# Altium schematic sheet SD.SchDoc
size A4
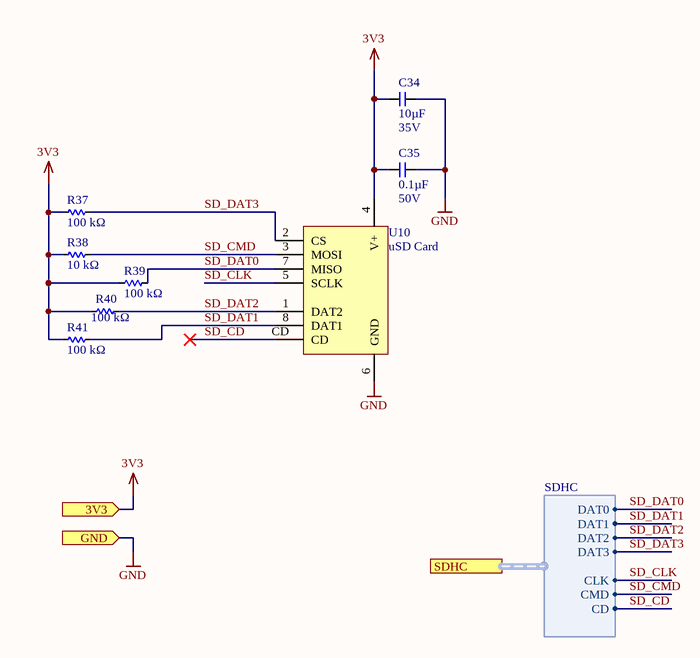
[diagram p0: SD.SchDoc]

## Parts
C34  Capacitance (shorthand): 10µF  Rated Voltage: 35V  [C0603]  (hidden comment: 490-13248-1-ND)
C35  Capacitance (shorthand): 0.1µF  Rated Voltage: 50V  [C0603]  (hidden comment: 490-1519-1-ND)
R37  Resistance: 100 kΩ  [R0603]  (hidden comment: 311-100KHRCT-ND)
R38  Resistance: 10 kΩ  [R0603]  (hidden comment: 311-10.0KHRCT-ND)
R39  Resistance: 100 kΩ  [R0603]  (hidden comment: 311-100KHRCT-ND)
R40  Resistance: 100 kΩ  [R0603]  (hidden comment: 311-100KHRCT-ND)
R41  Resistance: 100 kΩ  [R0603]  (hidden comment: 311-100KHRCT-ND)
U10  uSD Card  [MICROSD_CARD_SOCKET]

## Ports
3V3 (in), GND (in), SDHC (harness SDHC)

## Harnesses
SDHC: DAT3, DAT0, DAT2, DAT1, CLK, CMD, CD

## Nets
3V3: C34.2 C35.1 R37.1 R38.1 R39.1 R40.1 R41.1 U10.4(V+) ; port 3V3
GND: C34.1 C35.2 U10.6(GND) ; port GND
SD_CD: U10.CD ; port SDHC.CD
SD_CLK: U10.5(SCLK) ; port SDHC.CLK
SD_CMD: R38.2 U10.3(MOSI) ; port SDHC.CMD
SD_DAT0: R39.2 U10.7(MISO) ; port SDHC.DAT0
SD_DAT1: R41.2 U10.8(DAT1) ; port SDHC.DAT1
SD_DAT2: R40.2 U10.1(DAT2) ; port SDHC.DAT2
SD_DAT3: R37.2 U10.2(CS) ; port SDHC.DAT3

## Notes on the sheet
- Title
- Size:
- Date:
- A4
- Number:
- Time:
- Revision:
- Sheet
- of
- File:

## Library data of the parts
C34 = CMP-119-0071-1: CAP CER 10UF 35V X5R 0603 20%; Manufacturer: Murata Electronics North America; Capacitance - pF (Machine readable): #NAME?; Dielectric: X5R
C35 = CMP-119-0065-1: CAP CER 0603 0.1µF X7R 50V 10%; Manufacturer: Murata Electronics North America; Capacitance - pF (Machine readable): #NAME?; Dielectric: X7R
R37 R39-R41 = CMP-126-0382-2: RES SMD 100K OHM 1% 1/10W 0603; Manufacturer Part Number: RC0603FR-07100KL; Manufacturer: Yageo; Resistance (Sortable): 100000; Power (Watts): 0.1W, 1/10W; Temperature Coefficient: ±100ppm/°C; Datasheets: http://www.yageo.com/documents/recent/PYu-RC_Group_51_RoHS_L_9.pdf; Image: //media.digikey.com/Renders/Yageo%20Renders/0603-(1608-Metric).jpg; Tolerance: ±1%; Operating Temperature: -55°C ~ 155°C
R38 = CMP-126-0273-2: RES SMD 10K OHM 1% 1/10W 0603; Manufacturer Part Number: RC0603FR-0710KL; Manufacturer: Yageo; Resistance (Sortable): 10000; Power (Watts): 0.1W, 1/10W; Temperature Coefficient: ±100ppm/°C; Datasheets: http://www.yageo.com/documents/recent/PYu-RC_Group_51_RoHS_L_9.pdf; Image: //media.digikey.com/Renders/Yageo%20Renders/0603-(1608-Metric).jpg; Tolerance: ±1%; Operating Temperature: -55°C ~ 155°C
U10 = CMP-030-0037-1: MICROSD CARD HOLDER, PUSH-PUSH; Manufacturer: 3M; Manufacturer Part Number: 2908-05WB-MG; Card Type: Secure Digital - microSD™; Number of Positions: 10 (8 + 2); Connector Type: Connector and Ejector; Insertion, Removal Method: Push In, Push Out; RoHS: RoHS Compliant; Stock 1: 32313; Pricing 1: 1=3.6, 10=3.458, 25=3.1704, 50=3.0262, 100=2.882, 250=2.52176, 500=2.4497, 1000=2.08945 (USD); Packaging: Cut Tape (CT); Ejector Side: -; Mounting Type: Surface Mount, Right Angle; Features: Switch; Height Above Board: 0.073" (1.85mm); Mounting Feature: Normal, Standard - Top; Contact Finish: Gold; Contact Finish Thickness: 15µin (0.38µm); ComponentLink1URL: http://multimedia.3m.com/mws/media/416257O/3mtm-card-connector-microsdtm-2900-series-ts2197.pdf; ComponentLink1Description: http://multimedia.3m.com/mws/media/416257O/3mtm-card-connector-microsdtm-2900-series-ts2197.pdf; Source: connector.SchLib; Design Item ID: MICRO_SD_CARD_HOLDER